# EAGLE design Proto-Pi (EAGLE 9.6.2)

## Sheet 1 of 2: Connectors
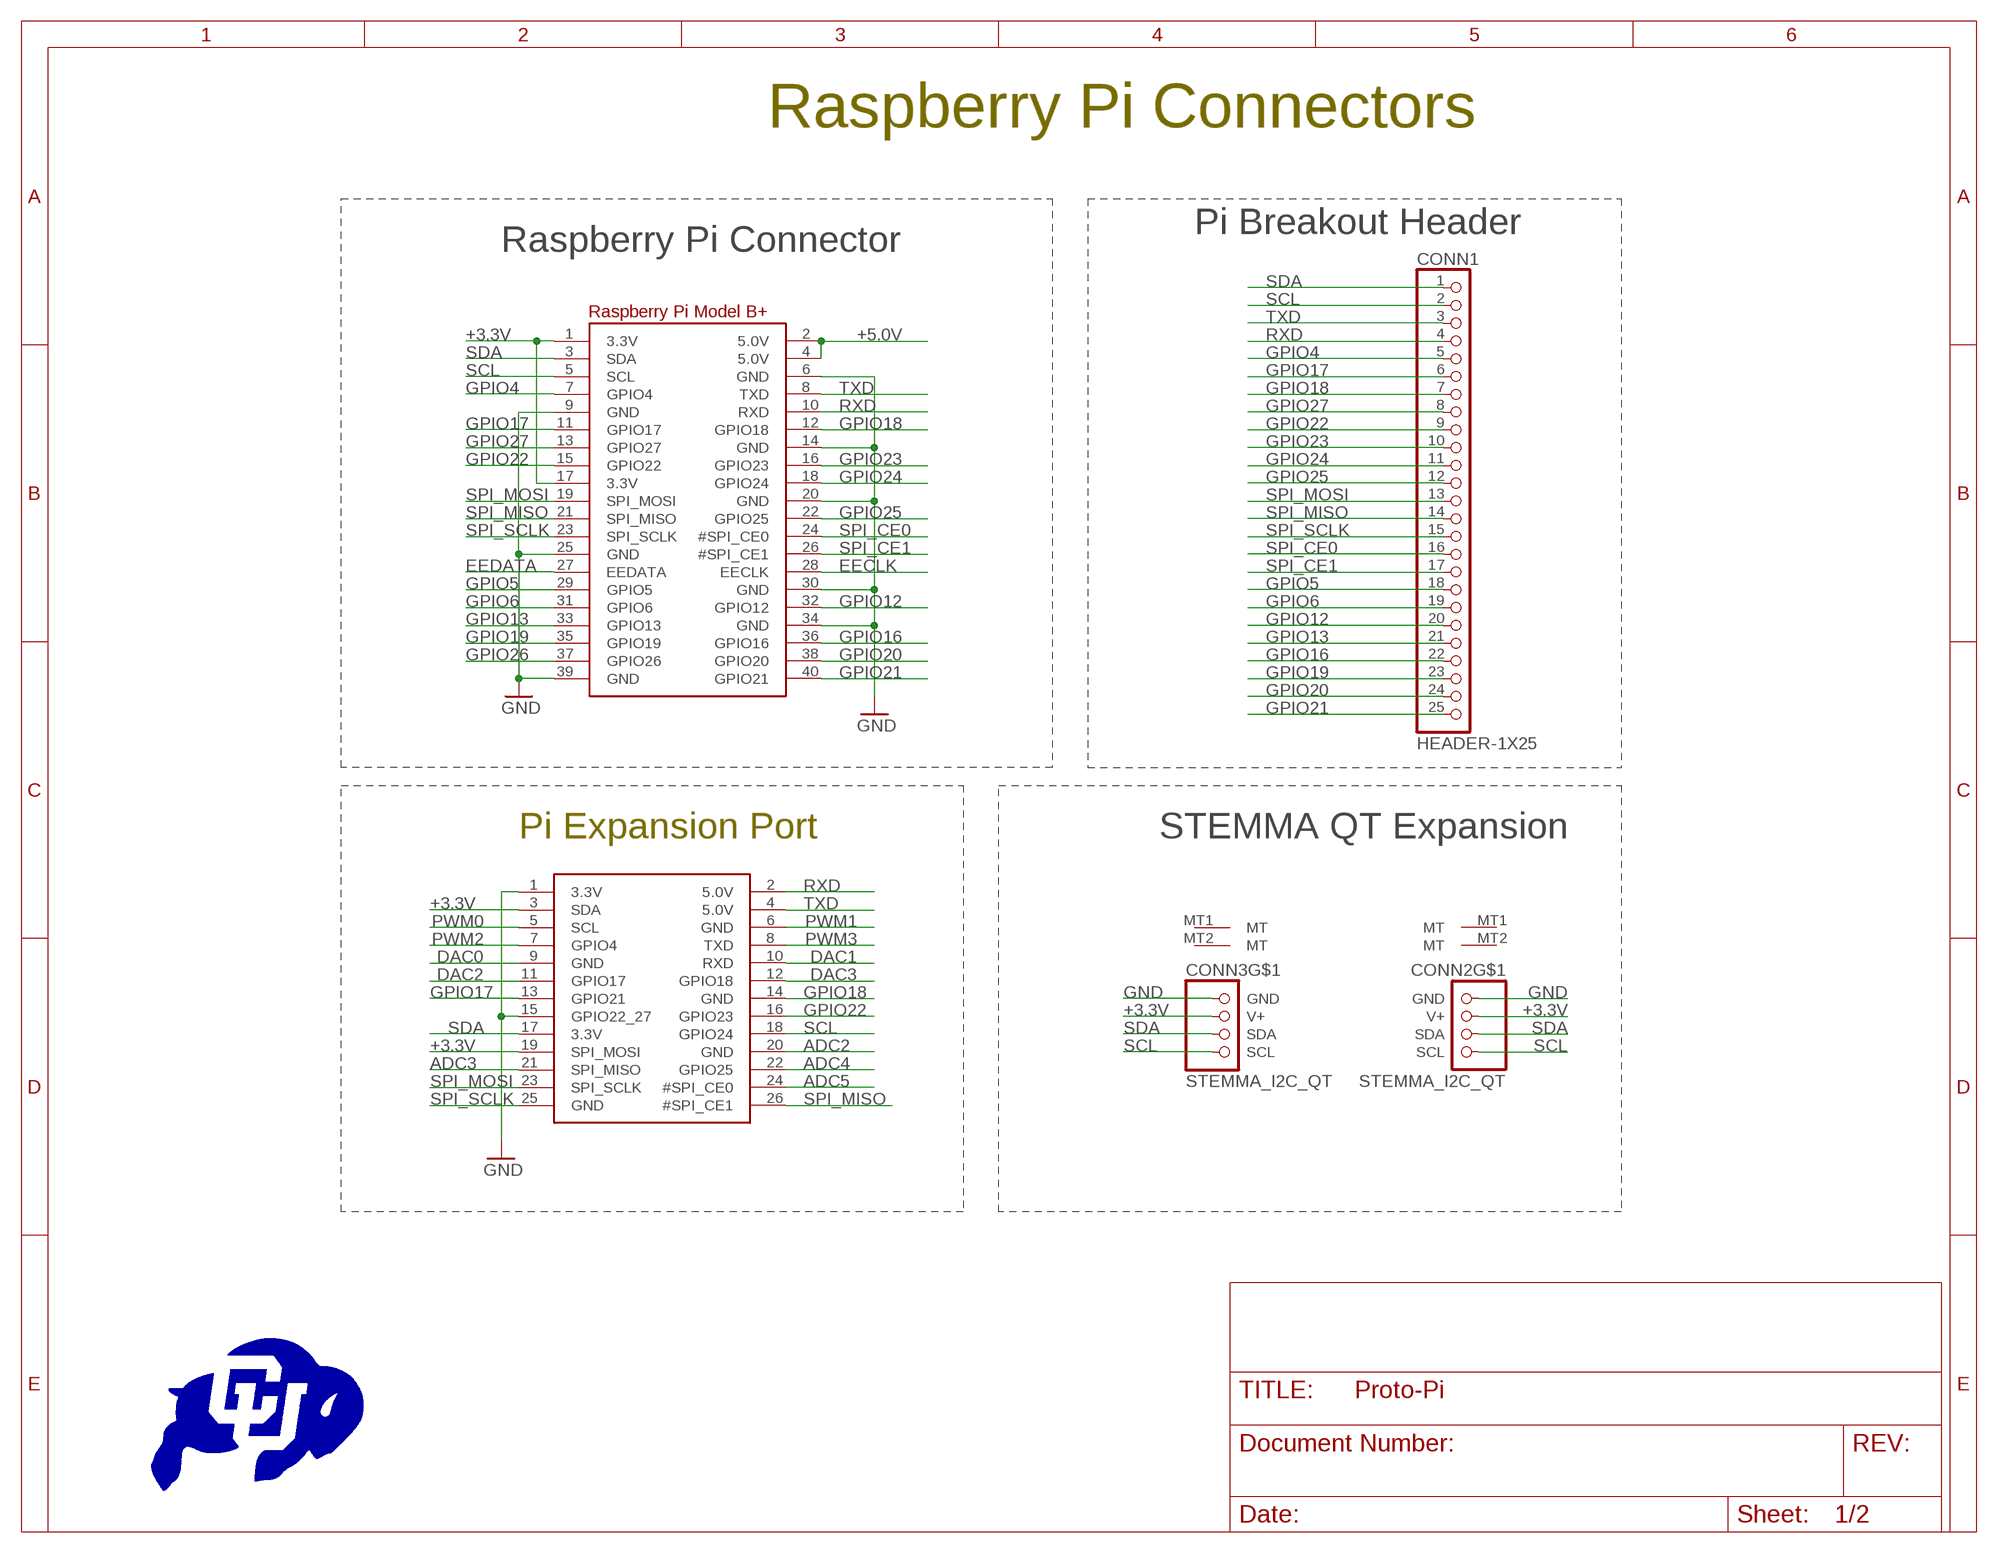
[diagram p0: schematic, sheet 1]

### Parts
CONN1  HEADER-1X25  [1X25_ROUND_70MIL]
CONN2  STEMMA_I2C_QT  [JST_SH4]
CONN3  STEMMA_I2C_QT  [JST_SH4]
JP1  RASBERRYPI_IDC  [RASBERRYPI_IDC]
P1  ART-CU-LOGO  [CU_LOGO]
RPI1  RASPBERRYPI_BPLUS_BONNETNODIM  [PI_BONNET_NODIM]

### Nets
+3.3V: CONN2.2(V+) CONN3.2(V+) JP1.3(SDA) JP1.19(SPI_MOSI) RPI1.1(3.3V) RPI1.17(3.3V) ; also sheet 2
+5.0V: RPI1.2(5.0V) RPI1.4(5.0V)
ADC2: JP1.20(GND) ; also sheet 2
ADC3: JP1.21(SPI_MISO) ; also sheet 2
ADC4: JP1.22(GPIO25) ; also sheet 2
ADC5: JP1.24(#SPI_CE0) ; also sheet 2
DAC0: JP1.9(GND) ; also sheet 2
DAC1: JP1.10(RXD) ; also sheet 2
DAC2: JP1.11(GPIO17) ; also sheet 2
DAC3: JP1.12(GPIO18) ; also sheet 2
EECLK: RPI1.28(EECLK)
EEDATA: RPI1.27(EEDATA)
GND: CONN2.1(GND) CONN3.1(GND) JP1.1(3.3V) JP1.15(GPIO22_27) RPI1.6(GND) RPI1.9(GND) RPI1.14(GND) RPI1.20(GND) RPI1.25(GND) RPI1.30(GND) RPI1.34(GND) RPI1.39(GND) ; also sheet 2
GPIO4: CONN1.5 RPI1.7(GPIO4)
GPIO5: CONN1.18 RPI1.29(GPIO5)
GPIO6: CONN1.19 RPI1.31(GPIO6)
GPIO12: CONN1.20 RPI1.32(GPIO12)
GPIO13: CONN1.21 RPI1.33(GPIO13)
GPIO16: CONN1.22 RPI1.36(GPIO16)
GPIO17: CONN1.6 JP1.13(GPIO21) RPI1.11(GPIO17)
GPIO18: CONN1.7 JP1.14(GND) RPI1.12(GPIO18)
GPIO19: CONN1.23 RPI1.35(GPIO19)
GPIO20: CONN1.24 RPI1.38(GPIO20)
GPIO21: CONN1.25 RPI1.40(GPIO21)
GPIO22: CONN1.9 JP1.16(GPIO23) RPI1.15(GPIO22)
GPIO23: CONN1.10 RPI1.16(GPIO23)
GPIO24: CONN1.11 RPI1.18(GPIO24)
GPIO25: CONN1.12 RPI1.22(GPIO25)
GPIO26: RPI1.37(GPIO26)
GPIO27: CONN1.8 RPI1.13(GPIO27)
PWM0: JP1.5(SCL) ; also sheet 2
PWM1: JP1.6(GND) ; also sheet 2
PWM2: JP1.7(GPIO4) ; also sheet 2
PWM3: JP1.8(TXD) ; also sheet 2
RXD: CONN1.4 JP1.2(5.0V) RPI1.10(RXD)
SCL: CONN1.2 CONN2.4(SCL) CONN3.4(SCL) JP1.18(GPIO24) RPI1.5(SCL) ; also sheet 2
SDA: CONN1.1 CONN2.3(SDA) CONN3.3(SDA) JP1.17(3.3V) RPI1.3(SDA) ; also sheet 2
SPI_CE0: CONN1.16 RPI1.24(#SPI_CE0) ; also sheet 2
SPI_CE1: CONN1.17 RPI1.26(#SPI_CE1)
SPI_MISO: CONN1.14 JP1.26(#SPI_CE1) RPI1.21(SPI_MISO) ; also sheet 2
SPI_MOSI: CONN1.13 JP1.23(SPI_SCLK) RPI1.19(SPI_MOSI) ; also sheet 2
SPI_SCLK: CONN1.15 JP1.25(GND) RPI1.23(SPI_SCLK) ; also sheet 2
TXD: CONN1.3 JP1.4(5.0V) RPI1.8(TXD)
Unconnected: CONN2.MT1(MT) CONN2.MT2(MT) CONN3.MT1(MT) CONN3.MT2(MT)

### Notes on the sheet
- Raspberry Pi Connectors
- Pi Breakout Header
- Raspberry Pi Connector
- Pi Expansion Port | STEMMA QT Expansion

## Sheet 2 of 2: Data Conversion
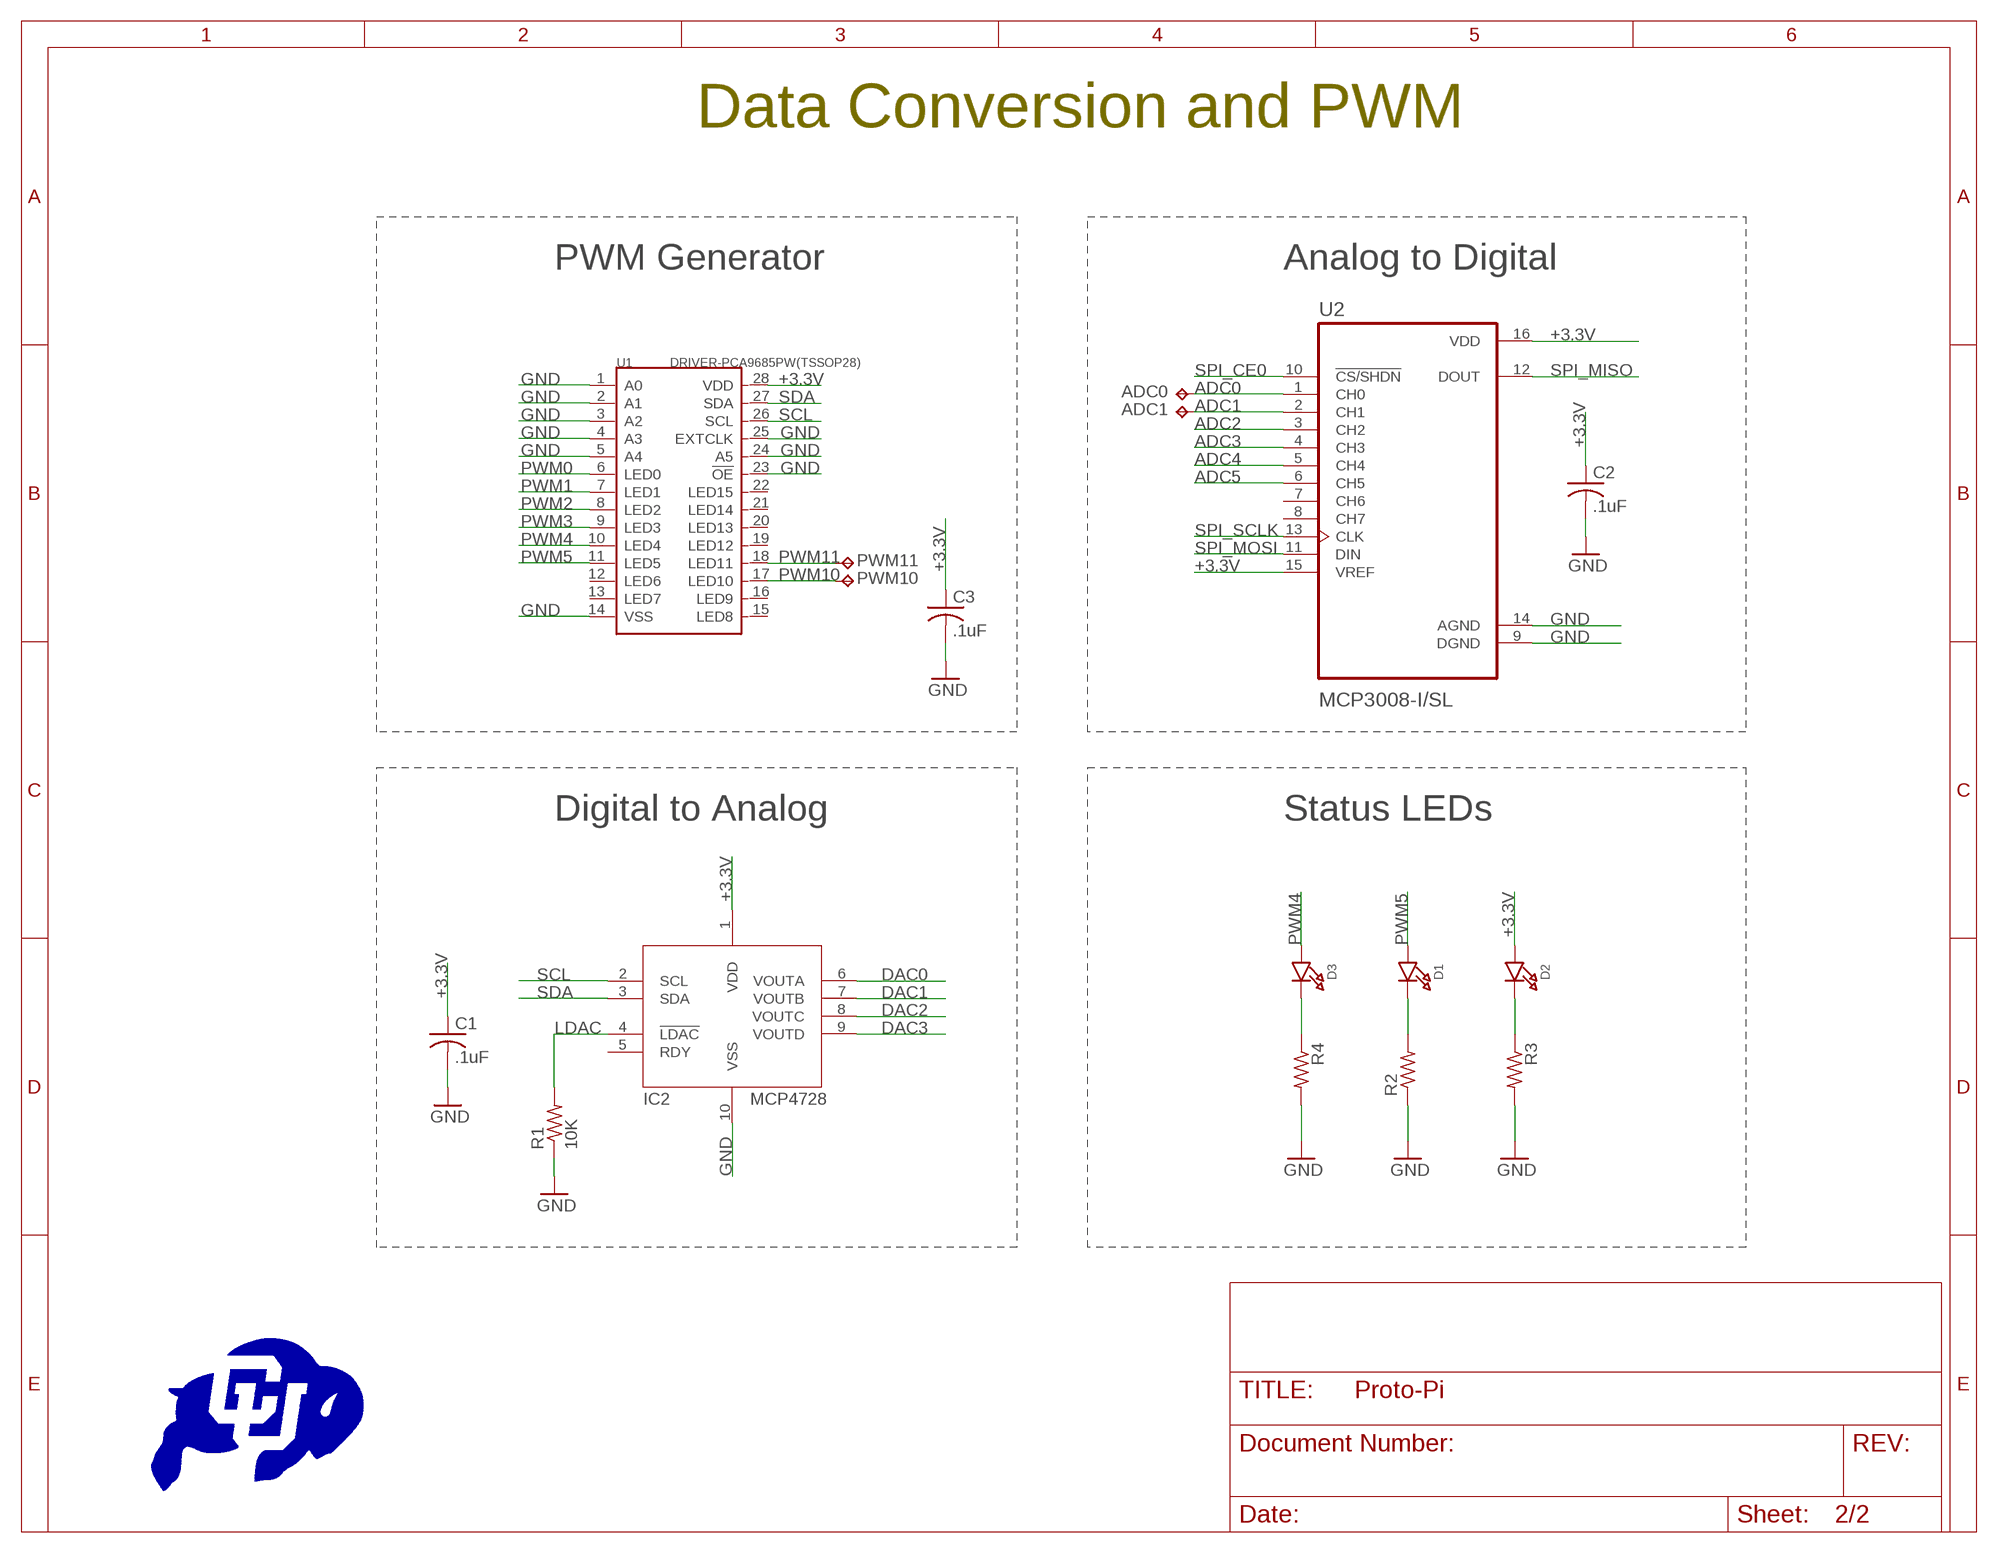
[diagram p1: schematic, sheet 2]

### Parts
ADC0  TPTP20R  [TP20R]
ADC1  TPTP20R  [TP20R]
C1  .1uF  C-USC0603  [C0603]
C2  .1uF  C-USC0603  [C0603]
C3  .1uF  C-USC0603  [C0603]
D1  LED0603_NOOUTLINE  [CHIPLED_0603_NOOUTLINE]
D2  LED0603_NOOUTLINE  [CHIPLED_0603_NOOUTLINE]
D3  LED0603_NOOUTLINE  [CHIPLED_0603_NOOUTLINE]
IC2  MCP4728  [MSOP10]
P2  ART-CU-LOGO  [CU_LOGO]
PWM10  TPTP20R  [TP20R]
PWM11  TPTP20R  [TP20R]
R1  10K  R-US_R0603  [R0603]
R2  R-US_R0402  [R0402]
R3  R-US_R0402  [R0402]
R4  R-US_R0402  [R0402]
U1  DRIVER-PCA9685PW(TSSOP28)  [TSSOP28-0.65-9.7X4.4MM]
U2  MCP3008-I/SL  [SOIC127P600X175-16N]

### Nets
+3.3V: C1.1 C2.1 C3.1 D2.A IC2.1(VDD) U1.28(VDD) U2.15(VREF) U2.16(VDD) ; also sheet 1
ADC0: ADC0.TP U2.1(CH0)
ADC1: ADC1.TP U2.2(CH1)
ADC2: U2.3(CH2) ; also sheet 1
ADC3: U2.4(CH3) ; also sheet 1
ADC4: U2.5(CH4) ; also sheet 1
ADC5: U2.6(CH5) ; also sheet 1
DAC0: IC2.6(VOUTA) ; also sheet 1
DAC1: IC2.7(VOUTB) ; also sheet 1
DAC2: IC2.8(VOUTC) ; also sheet 1
DAC3: IC2.9(VOUTD) ; also sheet 1
GND: C1.2 C2.2 C3.2 IC2.10(VSS) R1.1 R2.1 R3.2 R4.2 U1.1(A0) U1.2(A1) U1.3(A2) U1.4(A3) U1.5(A4) U1.14(VSS) U1.23(!OE) U1.24(A5) U1.25(EXTCLK) U2.9(DGND) U2.14(AGND) ; also sheet 1
LDAC: IC2.4(!LDAC) R1.2
N$1: D1.C R2.2
N$2: D2.C R3.1
N$3: D3.C R4.1
PWM0: U1.6(LED0) ; also sheet 1
PWM1: U1.7(LED1) ; also sheet 1
PWM2: U1.8(LED2) ; also sheet 1
PWM3: U1.9(LED3) ; also sheet 1
PWM4: D3.A U1.10(LED4)
PWM5: D1.A U1.11(LED5)
PWM10: PWM10.TP U1.17(LED10)
PWM11: PWM11.TP U1.18(LED11)
SCL: IC2.2(SCL) U1.26(SCL) ; also sheet 1
SDA: IC2.3(SDA) U1.27(SDA) ; also sheet 1
SPI_CE0: U2.10(!CS/SHDN) ; also sheet 1
SPI_MISO: U2.12(DOUT) ; also sheet 1
SPI_MOSI: U2.11(DIN) ; also sheet 1
SPI_SCLK: U2.13(CLK) ; also sheet 1
Unconnected: IC2.5(RDY) U1.12(LED6) U1.13(LED7) U1.15(LED8) U1.16(LED9) U1.19(LED12) U1.20(LED13) U1.21(LED14) U1.22(LED15) U2.7(CH6) U2.8(CH7)

### Notes on the sheet
- Data Conversion and PWM
- PWM Generator | Analog to Digital
- Digital to Analog | Status LEDs

## Library data of the parts
ADC0 ADC1 PWM10 PWM11 = testpad:TP: Test pad
C1-C3 = RLC:C-US: CAPACITOR, American symbol; ARROW_PN: ?; DATASHEET: ?; DESCRIPTION: ?; DIGI-KEY_PN: ?; MANUFACTURER: ?; MOUSER_PN: ?; PACKAGE: ?; PART_NUMBER: ?; SPICEPREFIX: C; TEMP_HIGH: ?; TEMP_LOW: ?; TOLERANCE: ?; TYPE: ?; WEIGHT_MG: 4.7
CONN1 = microbuilder:HEADER-1X25
CONN2 CONN3 = raspi:STEMMA_I2C
D1-D3 = raspi:LED: LED 0603 - 0603 Surface Mount Package 2mA: Green LED - Low Power (3.9mcd, 2ma, 1.7Vf) - Digikey: 475-2709-2-ND Orange LED - Low Power (9.8mcd, 2ma, 1.8Vf) - Digikey: 475-1194-2-ND Red LED - Low Power (5mcd, 2ma, 1.8Vf) - Digikey: 475-1195-2-ND Yellow LED - Low Power (7mcd, 2ma, 1.8Vf) - Digikey: 475-1196-2-ND 5mA: Blue LED - Low Power (17mcd, 5ma, 2.9Vf) - Digikey: LNJ937W8CRACT-ND 0805 - 0805 Surface Mount Package 2mA: Red LED (8.8mcd, 2mA, 1.8Vf, Clear) - Low Power [Digikey: 475-2510-1-ND] Green LED (5mcd, 2mA, 1.8Vf, Clear) - Low Power [Digikey: 475-2730-1-ND] Yellow LED (11.3mcd, 2mA, 1.8Vf, Clear) - Low Power [Digikey: 475-2555-1-ND] 20mA: Red LED (104mcd, 20mA, Diffused) - LS R976 [Digikey: 475-1278-6-ND] Red LED (12mcd, 20mA, 2.0Vf, Clear) - APT2012EC [Digikey: 754-1128-1-ND] Green LED (15mcd, 20mA, 2.2Vf, Clear) - APT2012GC [Digikey: 754-1131-1-ND] Orange LED (160mcd, 20mA, 2.1Vf, Clear) - APT2012SECK [Digikey: 754-1130-1-ND] 1206 - 1206 Surface Mount Package Green LED (26mcd, 20mA, Diffused) - LG N971 [Digikey: 475-1407-6-ND] Red LED (15mcd, 20mA, Diffused) - LH N974 [Digikey: 475-1416-6-ND] Cree - Cree High-Power Surface Mount LEDs XPEBWT-L1-0000-00D50 - White 111lm 350mA 2.9Vf 6200K 110° XTEAWT-00-0000-00000LEE3 - White 114lm 350mA 2.85Vf 5000K 115° Everlight - Everlight 45-21 Series Surface Mount LEDs 45-21/QK2C-B2832AC2CB2/2T - Warm White 2000mcd 20mA 3.25Vf 3050K 120° 45-21/LK2C-B38452C4CB2/2T - Nuetral White 2000mcd 20mA 3.25Vf 4150K 120° 45-21/LK2C-B50634C6CB2/2T - Cold White 2200mcd 20mA 3.25Vf 5650K 120° PLCC2 Reverse Mount LS T77K-J1L2-1-0-2-R18-Z - Red 11.25mcd 2mA 1.8Vf 630nm 120° LO T77K-L1M2-24-Z - Orange 19.6mcd 2mA 1.8Vf 606nm 120° LY T77K-K2M1-26-Z - Yellow 15.7mcd 2mA 1.8Vf 587nm 120°
IC2 = raspi:MCP4728
JP1 = raspi:RASBERRYPI_IDC: Rasberry PI IDC Header
P1 P2 = AIMRL:ART-CU-LOGO
R1 = RLC:R-US_: RESISTOR, American symbol; ARROW_PN: ?; DATASHEET: ?; DESCRIPTION: ?; DIGI-KEY_PN: ?; MANUFACTURER: ?; MOUSER_PN: ?; PACKAGE: ?; PART_NUMBER: ?; SPICEPREFIX: R; TEMP_HIGH: ?; TEMP_LOW: ?; TOLERANCE: ?; TYPE: ?; WEIGHT_MG: 2
R2-R4 = RLC:R-US_: RESISTOR, American symbol; ARROW_PN: ?; DATASHEET: ?; DESCRIPTION: ?; DIGI-KEY_PN: ?; MANUFACTURER: ?; MOUSER_PN: ?; PACKAGE: ?; PART_NUMBER: ?; SPICEPREFIX: R; TEMP_HIGH: ?; TEMP_LOW: ?; TOLERANCE: ?; TYPE: ?; WEIGHT_MG: .8
RPI1 = microbuilder:RASPBERRYPI_BPLUS
U1 = raspi:DRIVER-PCA9685PW(TSSOP28): 310030252 Check prices <https://pricing.snapeda.com/parts/PCA9685PW/NXP%20USA/view-part?ref=eda>; AVAILABILITY: In Stock; DESCRIPTION: LED Driver IC 16 Output Linear - PWM Dimming 25mA 28-TSSOP; MF: NXP USA; MP: PCA9685PW; PACKAGE: None; PRICE: None; PURCHASE-URL: https://pricing.snapeda.com/search/part/PCA9685PW/?ref=eda
U2 = raspi:MCP3008-I/SL: Check prices <https://pricing.snapeda.com/parts/MCP3008-I/SL/Microchip%20Technology/view-part?ref=eda>; AVAILABILITY: In Stock; DESCRIPTION: 10 Bit Analog to Digital Converter 4, 8 Input 1 SAR 16-SOIC; MF: Microchip Technology; MP: MCP3008-I/SL; PACKAGE: None; PRICE: None; PURCHASE-URL: https://pricing.snapeda.com/search/part/MCP3008-I/SL/?ref=eda

## Board
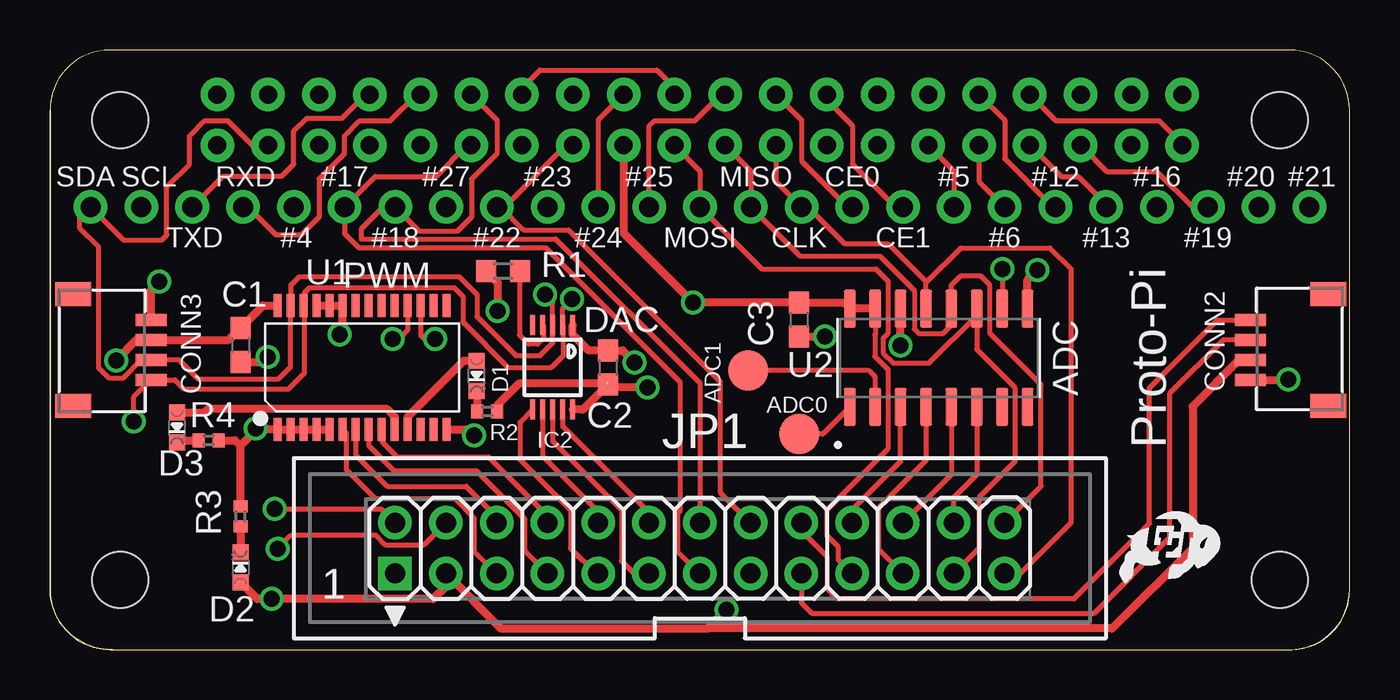
[diagram p2: board, top side]
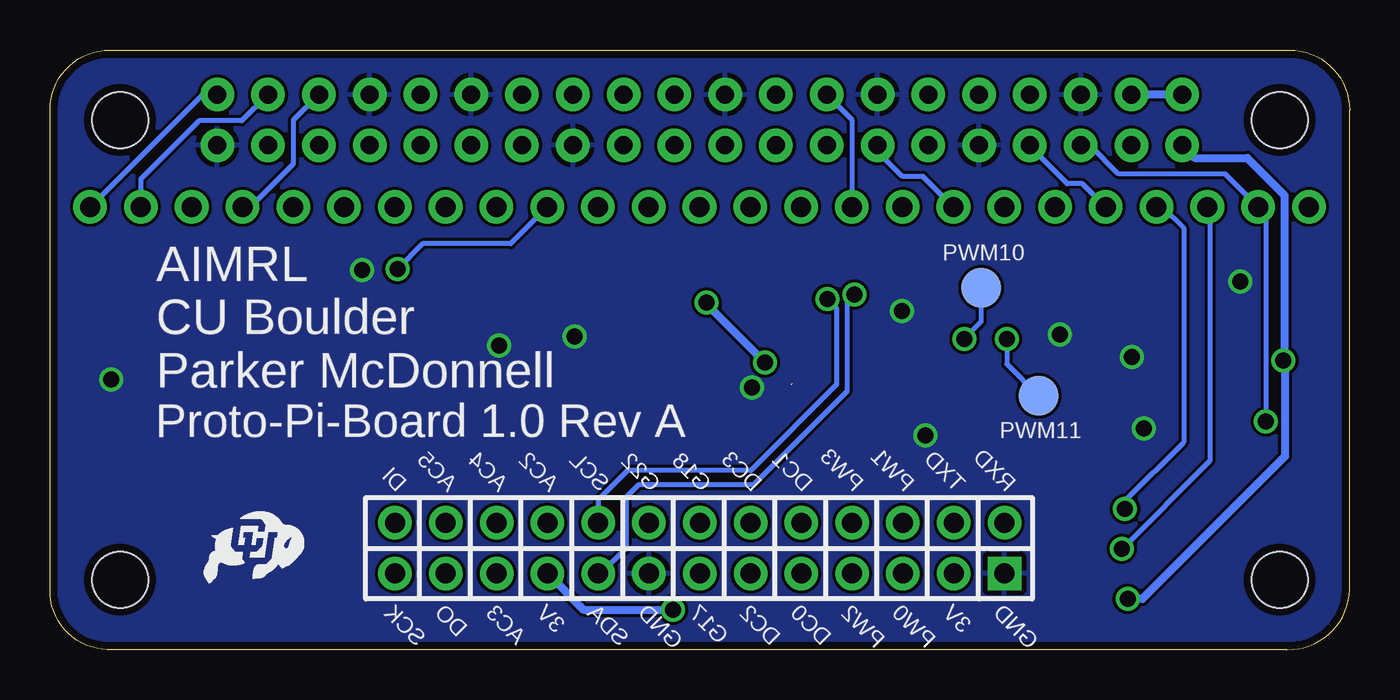
[diagram p3: board, bottom side, seen from below]

Size 65 x 30 mm. Coordinates in mm from the lower left corner, seen from the top.
Outline: 3.13,0 62.13,0 arc90 65,3 65,27 arc90 62,30 3,30 arc90 0,27 0,3 arc90 3.13,0
Copper layers (1*16): Top 0.035559375mm / dielectric 1.6mm / Bottom 0.035559375mm
Design rules "oshpark-2layer": minimum track width 6mil, minimum drill 10mil, track to track 6mil, track to pad 6mil, pad to pad 6mil, via to via 6mil, smd to smd 6mil, copper to edge 15mil, drill to drill 6mil, minimum pad ring 5mil, minimum via ring 5mil, stop-mask expansion 2.5mil, vias tented up to drill 0mil, thermal gap 10mil

### Footprints (pad centres in the part's own frame; a part is rotated, then mirrored left to right if it is on the bottom)
TP20R = smd 2 x 2: TP 0,0
C0603 = smd 1.1 x 1: 1 -0.85,0; 2 0.85,0
1X25_ROUND_70MIL = drill 1 pad 1.676: 1 -30.48,0; 2 -27.94,0; 3 -25.4,0; 4 -22.86,0; 5 -20.32,0; 6 -17.78,0; 7 -15.24,0; 8 -12.7,0; 9 -10.16,0; 10 -7.62,0; 11 -5.08,0; 12 -2.54,0; 13 0,0; 14 2.54,0; 15 5.08,0; 16 7.62,0; 17 10.16,0; 18 12.7,0; 19 15.24,0; 20 17.78,0; 21 20.32,0; 22 22.86,0; 23 25.4,0; 24 27.94,0; 25 30.48,0
JST_SH4 = smd 0.6 x 1.55: 1 -1.5,2.514; 2 -0.5,2.514; 3 0.5,2.514; 4 1.5,2.514 | smd 1.2 x 1.8: MT1 -2.8,-1.386; MT2 2.8,-1.386
CHIPLED_0603_NOOUTLINE = smd 0.8 x 0.8: A 0,-0.75; C 0,0.75
MSOP10 = smd 0.25 x 1: 1 -1,-2.113; 2 -0.5,-2.113; 3 0,-2.113; 4 0.5,-2.113; 5 1,-2.113; 6 1,2.113; 7 0.5,2.113; 8 0,2.113; 9 -0.5,2.113; 10 -1,2.113
RASBERRYPI_IDC = drill 1 pad 1.676 square: 1 -1.27,15.24 | drill 1 pad 1.676: 2 1.27,15.24; 3 -1.27,12.7; 4 1.27,12.7; 5 -1.27,10.16; 6 1.27,10.16; 7 -1.27,7.62; 8 1.27,7.62; 9 -1.27,5.08; 10 1.27,5.08; 11 -1.27,2.54; 12 1.27,2.54; 13 -1.27,0; 14 1.27,0; 15 -1.27,-2.54; 16 1.27,-2.54; 17 -1.27,-5.08; 18 1.27,-5.08; 19 -1.27,-7.62; 20 1.27,-7.62; 21 -1.27,-10.16; 22 1.27,-10.16; 23 -1.27,-12.7; 24 1.27,-12.7; 25 -1.27,-15.24; 26 1.27,-15.24
R0603 = smd 1 x 1.1: 1 -0.85,0; 2 0.85,0
R0402 = smd 0.6 x 0.7: 1 -0.5,0; 2 0.5,0
PI_BONNET_NODIM = drill 0.9 pad 1.676: 1 8.37,25.23; 2 8.37,27.77; 3 10.91,25.23; 4 10.91,27.77; 5 13.45,25.23; 6 13.45,27.77; 7 15.99,25.23; 8 15.99,27.77; 9 18.53,25.23; 10 18.53,27.77; 11 21.07,25.23; 12 21.07,27.77; 13 23.61,25.23; 14 23.61,27.77; 15 26.15,25.23; 16 26.15,27.77; 17 28.69,25.23; 18 28.69,27.77; 19 31.23,25.23; 20 31.23,27.77; 21 33.77,25.23; 22 33.77,27.77; 23 36.31,25.23; 24 36.31,27.77; 25 38.85,25.23; 26 38.85,27.77; 27 41.39,25.23; 28 41.39,27.77; 29 43.93,25.23; 30 43.93,27.77; 31 46.47,25.23; 32 46.47,27.77; 33 49.01,25.23; 34 49.01,27.77; 35 51.55,25.23; 36 51.55,27.77; 37 54.09,25.23; 38 54.09,27.77; 39 56.63,25.23; 40 56.63,27.77 | hole 2.8: 3.5,3.5; 3.5,26.5; 61.5,26.5; 61.5,3.5
TSSOP28-0.65-9.7X4.4MM = smd 0.4 x 1.15: 1 -4.225,-3.1; 2 -3.575,-3.1; 3 -2.925,-3.1; 4 -2.275,-3.1; 5 -1.625,-3.1; 6 -0.975,-3.1; 7 -0.325,-3.1; 8 0.325,-3.1; 9 0.975,-3.1; 10 1.625,-3.1; 11 2.275,-3.1; 12 2.925,-3.1; 13 3.575,-3.1; 14 4.225,-3.1; 15 4.225,3.1; 16 3.575,3.1; 17 2.925,3.1; 18 2.275,3.1; 19 1.625,3.1; 20 0.975,3.1; 21 0.325,3.1; 22 -0.325,3.1; 23 -0.975,3.1; 24 -1.625,3.1; 25 -2.275,3.1; 26 -2.925,3.1; 27 -3.575,3.1; 28 -4.225,3.1
SOIC127P600X175-16N = smd 1.9 x 0.6: 1 -2.455,4.445; 2 -2.455,3.175; 3 -2.455,1.905; 4 -2.455,0.635; 5 -2.455,-0.635; 6 -2.455,-1.905; 7 -2.455,-3.175; 8 -2.455,-4.445; 9 2.455,-4.445; 10 2.455,-3.175; 11 2.455,-1.905; 12 2.455,-0.635; 13 2.455,0.635; 14 2.455,1.905; 15 2.455,3.175; 16 2.455,4.445

### Placement (x,y rotation side)
ADC0  37.47,10.79 0 top
ADC1  34.92,13.96 0 top
C1  9.53,15.23 270 top
C2  27.91,14.11 270 top
C3  37.47,16.5 270 top
CONN1  32.51,22.14 0 top
CONN2  62.56,14.99 90 top
CONN3  2.54,14.99 270 top
D1  21.35,13.7 180 top
D2  9.53,4.12 0 top
D3  6.35,11.1 180 top
IC2  25.15,14.11 180 top
JP1  32.5,5.07 90 top
P1  53.34,3.17 0 top
P2  57.47,3.17 0 bottom
PWM10  18.41,18.09 0 bottom
PWM11  15.56,12.69 0 bottom
R1  22.66,18.94 0 top
R2  21.87,11.92 180 top
R3  9.53,6.66 90 top
R4  7.94,10.47 0 top
RPI1  0,0 0 top
U1  15.62,14.11 0 top
U2  44.45,14.6 90 top

### Tracks (layer width: path | path; a pad name or v marks a point on that pad's centre or on a via)
+3.3V  (via drill 0.8)
  Top 0.254: U2.15 41.27,15.76 41.26,15.74 41.26,14.67 41.91,14.02 41.91,10.04 38.85,6.98 38.85,5.71 39.43,5.13 39.43,4.5 JP1.19
  Top 0.406: RPI1.17 28.69,20.83 v32.16,17.36 C3.1 39.7,17.35 U2.16 U2.15 | U1.28 10.66,17.21 C1.1 8.94,15.49 CONN3.2 4.32,15.49 v3.3,14.47 | IC2.1 26.15,15.76 26.94,14.96 C2.1 28.64,14.96 v29.24,14.37 | 32.89,1.06 53.14,1.06 57.15,5.07 57.15,12.17 59.47,14.49 CONN2.2 | v33.83,2 32.89,1.06 | D2.A 10.36,2.53 v11.1,2.53 19.16,2.53 19.8,3.17 JP1.3 22.54,1.06 32.89,1.06
  Bottom 0.406: RPI1.1 7.74,24.6 5.11,24.6 3.25,22.74 3.25,14.52 v3.3,14.47 3.23,14.4 3.23,9.66 10.36,2.53 v11.1,2.53 | v32.16,17.36 32.16,17.3 v29.24,14.37 | JP1.19 38.32,2 v33.83,2
+5.0V
  Bottom 0.406: RPI1.2 RPI1.4
ADC0
  Top 0.254: U2.1 38.65,10.79 ADC0.TP
ADC1
  Top 0.254: U2.2 41.27,13.64 40.96,13.96 ADC1.TP
ADC2
  Top 0.254: U2.3 42.55,9.4 40.12,6.98 JP1.20
ADC3
  Top 0.254: U2.4 43.81,9.46 41.44,7.08 41.44,5.02 JP1.21
ADC4
  Top 0.254: U2.5 45.09,8.77 JP1.22
ADC5
  Top 0.254: U2.6 46.35,8.77 45.2,7.61 JP1.24
DAC0
  Top 0.254: IC2.6 23.51,11.37 23.51,9.5 26.04,6.98 26.04,5.07 27.3,3.8 JP1.9
DAC1
  Top 0.254: IC2.7 24.65,9.69 27.42,6.91 JP1.10
DAC2
  Top 0.254: IC2.8 25.15,10.43 28.57,7 28.57,4.44 29.21,3.8 JP1.11
DAC3
  Top 0.254: IC2.9 25.65,11.18 29.96,6.86 JP1.12
GND  (via drill 0.8)  (1 unrouted)
  Top 0.254: RPI1.34 50.32,26.46 55.5,26.46 56.63,25.33 RPI1.39 | RPI1.14 23.61,28.1 24.51,29 30.35,29 31.23,28.12 RPI1.20
  Top 0.406: 10.34,11.01 U1.1 U1.2 U1.3 U1.4 U1.5 | 10.34,11.01 v10.29,11.07 | U1.14 20.91,11.01 v21.21,10.71 | v42.55,15.21 U2.14 | v49.38,18.99 48.9,18.51 U2.9 | CONN2.1 61.52,13.49 61.8,13.37 v61.92,13.51 | C1.2 10.62,14.38 v10.88,14.64 | C3.2 v38.75,15.65 v38.76,15.66 | CONN3.1 5.05,18 v5.46,18.41 | IC2.10 26.65,12 C2.2 28.05,13.12 v29.9,13.12 | R1.1 22.39,18.36 v22.39,16.93 | R2.1 22.37,12.2 23.5,13.33 27.85,13.33 | R3.2 9.53,10.2 | 9.53,10.2 10.34,11.01 | U1.25 U1.24 U1.23 14.65,15.93 v14.48,15.77 | R4.2 9.26,10.47 9.53,10.2
  pour Bottom: 0,30.02 0,-0.21 64.74,-0.21 65.15,30.02
GPIO4
  Bottom 0.254: CONN1.5 13.36,23.31 14.12,23.31 15.99,25.18 RPI1.7
GPIO5
  Top 0.254: RPI1.29 45.21,23.95 CONN1.18
GPIO6
  Top 0.254: RPI1.31 46.47,23.42 CONN1.19
GPIO12
  Top 0.254: RPI1.32 47.75,26.49 47.75,24.55 50.16,22.14 CONN1.20
GPIO13
  Top 0.254: RPI1.33 50.58,23.67 51.44,23.67 52.83,22.27 CONN1.21
GPIO16
  Bottom 0.254: RPI1.36 52.83,26.49 52.83,24.3 54.99,22.14 CONN1.22
GPIO17
  Top 0.254: RPI1.11 20.87,25.23 19.3,23.67 16.26,23.67 CONN1.6 14.73,20.82 15.44,20.11 24.79,20.11 31.51,13.39 31.51,6.93 31.38,6.81 31.38,4.92 JP1.13
GPIO18
  Top 0.254: RPI1.12 22.35,26.49 22.35,24.81 21.08,23.54 21.08,21.63 20.37,20.92 18.49,20.92 CONN1.7 16.66,22.14 15.56,21.04 15.56,20.56 15.59,20.54 25.3,20.54 32.5,13.34 JP1.14
GPIO19
  Top 0.254: RPI1.35 52.86,23.92 55.37,23.92 57.15,22.14 CONN1.23
GPIO20
  Bottom 0.254: RPI1.38 55.4,26.46 57.53,26.46 60.45,23.54 CONN1.24
GPIO21
  Bottom 0.254: RPI1.40 57.36,27.77 CONN1.25
GPIO22
  Top 0.254: RPI1.15 25.82,25.23 22.73,22.14 CONN1.9 22.55,22.14 23.7,21 25.93,21 33.52,13.42 33.52,7.87 JP1.16
GPIO23
  Bottom 0.254: RPI1.16 24.89,26.51 CONN1.10
GPIO24
  Top 0.254: CONN1.11 27.43,26.51 RPI1.18
GPIO25
  Top 0.254: CONN1.12 29.97,26.21 30.23,26.46 32.26,26.46 33.57,27.77 RPI1.22
GPIO27
  Bottom 0.254: CONN1.8 21.34,23.67 22.35,23.67 23.61,24.92 RPI1.13
LDAC
  Top 0.254: IC2.4 24.68,16.2 24.68,15.56 24.4,15.28 23.94,15.28 23.48,15.75 23.48,18.92 R1.2
N$1
  Top 0.406: D1.C 21.37,12.93 R2.2
N$2
  Top 0.406: R3.1 D2.C
N$3
  Top 0.406: D3.C 6.46,10.47 R4.1
PWM0
  Top 0.254: U1.6 14.82,10.84 14.82,9.01 16.27,7.56 20.23,7.56 21.22,6.57 21.22,4.92 JP1.5
PWM1
  Top 0.254: U1.7 15.3,9.74 16.87,8.17 20.82,8.17 22.34,6.65 JP1.6
PWM2
  Top 0.254: U1.8 15.95,10.21 17.2,8.96 21.32,8.96 23.76,6.52 23.76,4.92 JP1.7
PWM3
  Top 0.254: U1.9 16.6,10.42 17.37,9.64 21.93,9.64 24.88,6.7 JP1.8
PWM4
  Top 0.406: D3.A 7.74,11.86 7.94,12.06 16.83,12.06 17.25,11.64 U1.10
PWM5
  Top 0.406: D1.A 20.7,14.45 17.9,11.64 U1.11
PWM10  (via drill 0.8)
  Top 0.254: U1.17 18.55,15.74 18.73,15.55 v19.27,15.55
  Bottom 0.254: v19.27,15.55 18.41,16.4 PWM10.TP
PWM11  (via drill 0.8)
  Top 0.254: U1.18 17.9,15.98 17.46,15.55 v17.14,15.55
  Bottom 0.254: v17.14,15.55 17.14,14.28 PWM11.TP
RXD  (via drill 0.8)
  Top 0.254: RPI1.10 18.33,27.77 17.02,26.46 15.49,26.46 14.73,25.7 14.73,24.81 13.46,23.54 13.46,21.63 12.57,20.74 11.3,20.74 9.91,22.14 CONN1.4 | 11.38,7.03 v11.23,7.03 16.57,7.03 JP1.2
  Bottom 0.254: CONN1.4 9.33,22.14 8.3,21.11 8.3,10.37 11.23,7.43 v11.23,7.03
SCL  (via drill 0.8)
  Top 0.254: v26.12,17.53 25.65,17.05 IC2.2 25.65,16.22 25.65,14.68 25.09,14.11 22.92,14.11 20.65,16.39 20.65,17.67 20.22,18.1 12.98,18.1 12.71,17.84 12.71,17.23 U1.26 12.71,17.2 12.71,13.82 11.95,13.05 6.69,13.05 6.25,13.49 CONN3.4 4.17,12.6 4.17,11.45 v4.19,11.42 | CONN2.4 58.38,16.49 54.99,13.1 54.99,6.31 51.22,2.53 39.37,2.53 38.85,3.05 38.85,4.67 37.58,5.94 JP1.18
  Bottom 0.254: RPI1.5 12.99,25.23 11.56,23.79 6.22,23.79 CONN1.2 4.18,21.75 v4.18,11.43 v4.19,11.42 | v26.12,17.53 25.65,17.06 25.65,13.25 29.95,8.96 36.12,8.96 37.58,7.5 JP1.18
SDA  (via drill 0.8)
  Top 0.254: RPI1.3 10.12,25.23 8.89,26.46 7.75,26.46 6.99,25.7 6.99,24.3 5.84,23.16 5.84,20.74 5.59,20.49 3.68,20.49 CONN1.1 1.7,22.14 1.47,21.91 1.47,21.13 2.42,20.18 2.42,14.11 2.94,13.59 3.68,13.59 4.59,14.5 CONN3.3 6.46,14.49 7.43,13.51 11.4,13.51 12.03,14.14 12.03,17.2 U1.27 12.04,17.22 12.04,18.22 12.48,18.66 20.46,18.66 21.36,17.76 21.36,16.65 23.3,14.71 24.52,14.71 25.15,15.33 IC2.3 25.15,17.39 v24.77,17.77 | CONN2.3 58.68,15.49 55.99,12.81 55.99,5.58 52.23,1.82 38.1,1.82 37.58,2.34 JP1.17
  Bottom 0.254: v24.77,17.77 25.12,17.42 25.12,12.95 29.82,8.25 35.56,8.25 36.2,7.61 36.2,5.07 37.47,3.8 JP1.17
SPI_CE0  (via drill 0.8)
  Top 0.254: RPI1.24 37.59,26.49 37.59,24.43 39.88,22.14 CONN1.16 | v47.62,19.04 U2.10
  Bottom 0.254: CONN1.16 41.96,20.31 46.35,20.31 v47.62,19.04
SPI_CE1
  Top 0.254: RPI1.26 38.85,27.49 40.13,26.21 40.13,24.3 42.29,22.14 CONN1.17
SPI_MISO
  Top 0.254: RPI1.21 35.05,23.95 CONN1.14 37.52,19.68 41.52,19.68 43.24,17.96 43.24,16.03 43.44,15.82 44.66,15.82 45.09,16.25 U2.12 45.09,18.23 45.57,18.71 46.53,18.71 46.99,18.26 46.99,15.85 49.57,13.27 49.57,8.17 JP1.26
SPI_MOSI
  Top 0.254: RPI1.19 32.51,23.95 CONN1.13 35.61,19.04 41.3,19.04 41.91,18.43 41.91,15.82 41.67,15.57 41.67,14.84 42.18,14.33 43.96,14.33 46.35,16.72 U2.11 46.35,15.01 48.26,13.11 48.26,9.4 46.47,7.61 46.47,5.07 JP1.23
SPI_SCLK
  Top 0.254: RPI1.23 36.31,23.42 CONN1.15 37.92,22.14 39.74,20.31 41.91,20.31 43.81,18.41 43.81,18.36 | U2.13 43.81,18.36 | 43.81,18.36 45.56,20.1 50.02,20.1 51.07,19.05 51.07,6.34 48.53,3.8 JP1.25
TXD  (via drill 0.8)
  Top 0.254: RPI1.8 15.79,27.77 14.61,26.59 12.83,26.59 12.19,25.95 12.19,24.3 11.56,23.67 8.64,23.67 CONN1.3 | v11.38,5.05 12.04,5.71 16.31,5.71 16.8,5.22 18.68,5.22 JP1.4
  Bottom 0.254: CONN1.3 6.97,22 6.97,9.44 v11.37,5.05 v11.38,5.05

### Text on the board
tPlace: SDA | SCL | RXD | #17 | #27 | #23 | #25 | MISO | CE0 | #5 | #12 | #16 | #20 | #21 | TXD | #4 | #18 | #22 | #24 | MOSI | CLK | CE1 | #6 | #13 | #19 | PWM | DAC | Proto-Pi | ADC
bPlace: AIMRL / CU Boulder / Parker McDonnell | Proto-Pi-Board 1.0 Rev A | RXD | TXD | PW1 | PW3 | DC1 | DC3 | G18 | G22 | SCL | AC2 | AC4 | AC5 | DI | GND | 3V | PW0 | PW2 | DC0 | DC2 | G17 | GND | SDA | 3V | AC3 | DO | SCK